# Altium schematic sheet MCU.SchDoc
size A4
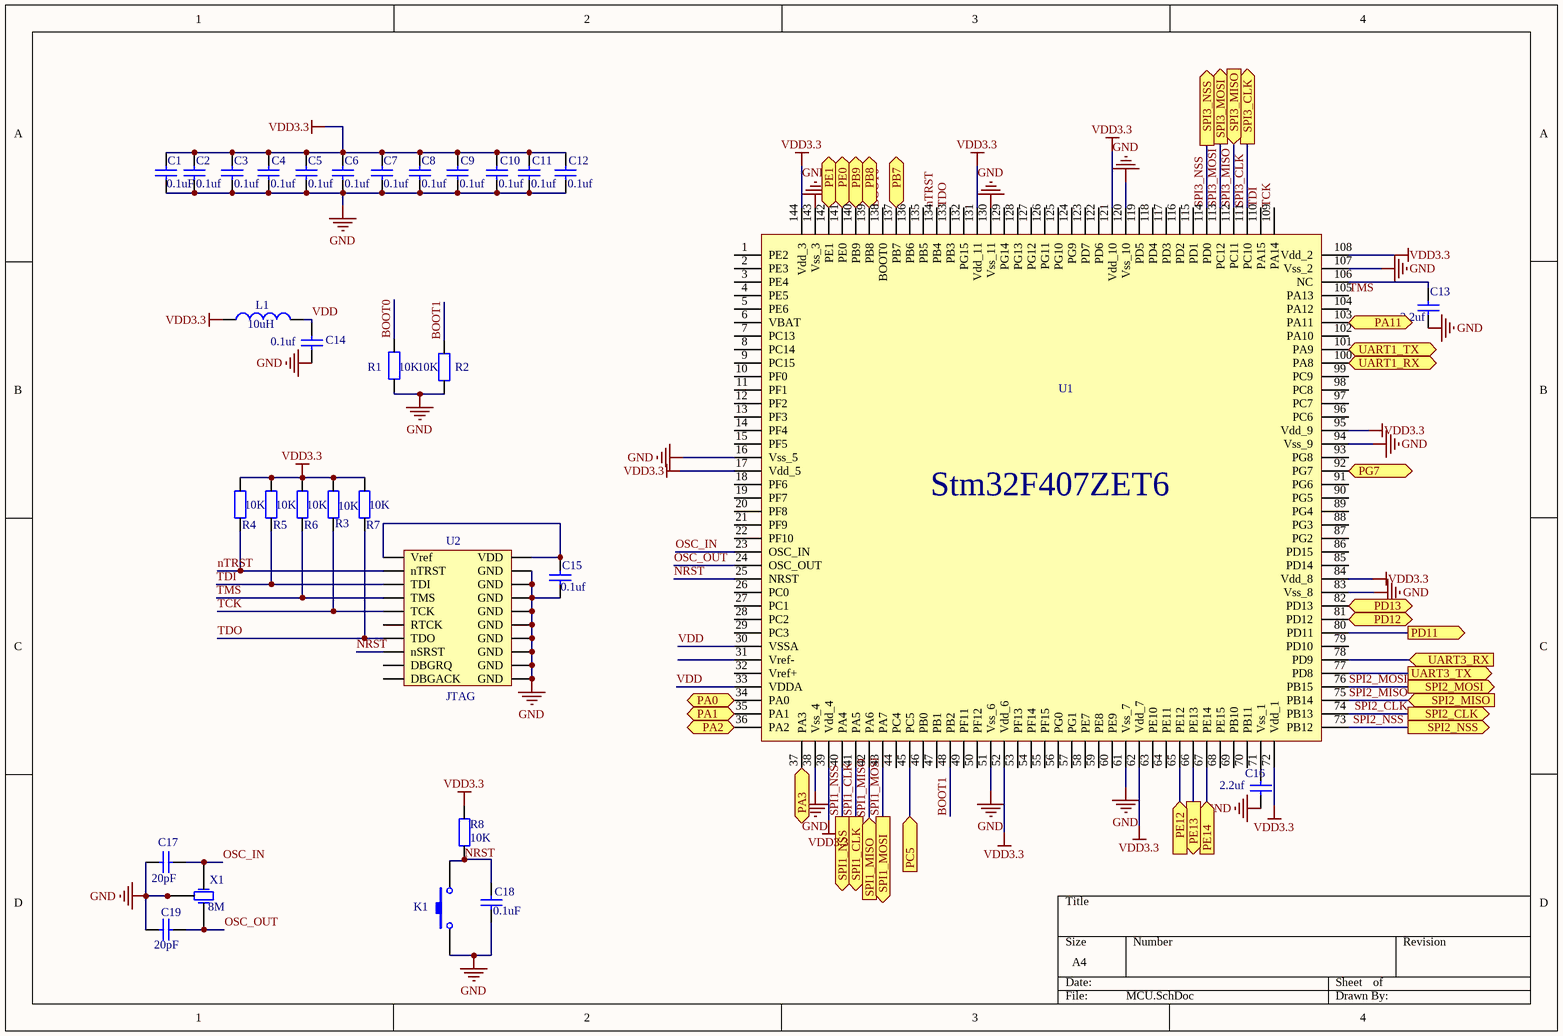
[diagram p0: MCU.SchDoc]

## Parts
C1  value 0.1uF  [0603]  (hidden comment: Capacitor-0805)
C2  value 0.1uf  [0603]  (hidden comment: Capacitor-0805)
C3  value 0.1uf  [0603]  (hidden comment: Capacitor-0805)
C4  value 0.1uf  [0603]  (hidden comment: Capacitor-0805)
C5  value 0.1uf  [0603]  (hidden comment: Capacitor-0805)
C6  value 0.1uf  [0603]  (hidden comment: Capacitor-0805)
C7  value 0.1uf  [0603]  (hidden comment: Capacitor-0805)
C8  value 0.1uf  [0603]  (hidden comment: Capacitor-0805)
C9  value 0.1uf  [0603]  (hidden comment: Capacitor-0805)
C10  value 0.1uf  [0603]  (hidden comment: Capacitor-0805)
C11  value 0.1uf  [0603]  (hidden comment: Capacitor-0805)
C12  value 0.1uf  [0603]  (hidden comment: Capacitor-0805)
C13  value 2.2uf  [0603]  (hidden comment: Capacitor-0603)
C14  value 0.1uf  [0603]  (hidden comment: Capacitor-0805)
C15  value 0.1uf  [0603]  (hidden comment: Capacitor-0805)
C16  value 2.2uf  [0603]  (hidden comment: Capacitor-0603)
C17  value 20pF  [0603]  (hidden comment: Capacitor-0805)
C18  value 0.1uF  [0603]  (hidden comment: Capacitor-0805)
C19  value 20pF  [0603]  (hidden comment: Capacitor-0805)
K1  按键  [贴片按键]  (value not drawn)
L1  value 10uH  [0805]  (hidden comment: Inductor)
R1  value 10K  [0603]  (hidden comment: Resistor-0805)
R2  value 10K  [0603]  (hidden comment: Resistor-0805)
R3  value 10K  [0603]  (hidden comment: Resistor-0805)
R4  value 10K  [0603]  (hidden comment: Resistor-0805)
R5  value 10K  [0603]  (hidden comment: Resistor-0805)
R6  value 10K  [0603]  (hidden comment: Resistor-0805)
R7  value 10K  [0603]  (hidden comment: Resistor-0805)
R8  value 10K  [0603]  (hidden comment: Resistor-0805)
U1  STM32F407ZET6  [Stm32f407ZET6 - duplicate]  (value not drawn)
U2  JTAG  [JTAG-20]
X1  value 8M  [3225无源晶振]  (hidden comment: 3225无源晶振)

## Ports
PA0 (in), PA1 (out), PA2 (out), PA3 (out), PA11 (out), PB7 (out), PB8 (out), PB9 (out), PC5 (in), PD11 (out), PD12, PD13, PE0 (out), PE1 (out), PE12 (in), PE13 (out), PE14 (in), PG7 (out), SPI1_CLK (out), SPI1_MISO (in), SPI1_MOSI (out), SPI1_NSS (out), SPI2_CLK (out), SPI2_MISO (in), SPI2_MOSI (out), SPI2_NSS (out), SPI3_CLK (out), SPI3_MISO (in), SPI3_MOSI (out), SPI3_NSS (out), UART1_RX (in), UART1_TX (out), UART3_RX (in), UART3_TX (out)

## Nets
GND: C1.1 C2.1 C3.1 C4.1 C5.1 C6.1 C7.1 C8.1 C9.1 C10.1 C11.1 C12.1 C13.1 C14.1 C15.1 C16.1 C17.1 C18.1 C19.1 K1.1 R1.1 R2.1 U1.16(Vss_5) U1.38(Vss_4) U1.51(Vss_6) U1.61(Vss_7) U1.83(Vss_8) U1.94(Vss_9) U1.107(Vss_2) U1.120(Vss_10) U1.130(Vss_11) U1.143(Vss_3) U2.4(GND) U2.6(GND) U2.8(GND) U2.10(GND) U2.12(GND) U2.14(GND) U2.16(GND) U2.18(GND) U2.20(GND) X1.2(GND) X1.4(GND)
VDD3.3: C1.2 C2.2 C3.2 C4.2 C5.2 C6.2 C7.2 C8.2 C9.2 C10.2 C11.2 C12.2 L1.1 R3.2 R4.2 R5.2 R6.2 R7.2 R8.2 U1.17(Vdd_5) U1.39(Vdd_4) U1.52(Vdd_6) U1.62(Vdd_7) U1.72(Vdd_1) U1.84(Vdd_8) U1.95(Vdd_9) U1.108(Vdd_2) U1.121(Vdd_10) U1.131(Vdd_11) U1.144(Vdd_3)
BOOT0: R1.2 U1.138(BOOT0)
BOOT1: R2.2 U1.48(PB2)
NRST: C18.2 K1.2 R8.1 U1.25(NRST) U2.15(nSRST)
nTRST: R4.1 U1.134(PB4) U2.3(nTRST)
OSC_IN: C17.2 U1.23(OSC_IN) X1.1(OSC1)
OSC_OUT: C19.2 U1.24(OSC_OUT) X1.3(OSC2)
PA0: U1.34(PA0) ; port PA0
PA1: U1.35(PA1) ; port PA1
PA2: U1.36(PA2) ; port PA2
PA3: U1.37(PA3) ; port PA3
PA11: U1.103(PA11) ; port PA11
PB7: U1.137(PB7) ; port PB7
PB8: U1.139(PB8) ; port PB8
PB9: U1.140(PB9) ; port PB9
PC5: U1.45(PC5) ; port PC5
PD11: U1.80(PD11) ; port PD11
PD12: U1.81(PD12) ; port PD12
PD13: U1.82(PD13) ; port PD13
PE0: U1.141(PE0) ; port PE0
PE1: U1.142(PE1) ; port PE1
PE12: U1.65(PE12) ; port PE12
PE13: U1.66(PE13) ; port PE13
PE14: U1.67(PE14) ; port PE14
PG7: U1.92(PG7) ; port PG7
SPI1_CLK: U1.41(PA5) ; port SPI1_CLK
SPI1_MISO: U1.42(PA6) ; port SPI1_MISO
SPI1_MOSI: U1.43(PA7) ; port SPI1_MOSI
SPI1_NSS: U1.40(PA4) ; port SPI1_NSS
SPI2_CLK: U1.74(PB13) ; port SPI2_CLK
SPI2_MISO: U1.75(PB14) ; port SPI2_MISO
SPI2_MOSI: U1.76(PB15) ; port SPI2_MOSI
SPI2_NSS: U1.73(PB12) ; port SPI2_NSS
SPI3_CLK: U1.111(PC10) ; port SPI3_CLK
SPI3_MISO: U1.112(PC11) ; port SPI3_MISO
SPI3_MOSI: U1.113(PC12) ; port SPI3_MOSI
SPI3_NSS: U1.114(PD0) ; port SPI3_NSS
TCK: R3.1 U1.109(PA14) U2.9(TCK)
TDI: R5.1 U1.110(PA15) U2.5(TDI)
TDO: R7.1 U1.133(PB3) U2.13(TDO)
TMS: R6.1 U1.105(PA13) U2.7(TMS)
UART1_RX: U1.100(PA8) ; port UART1_RX
UART1_TX: U1.101(PA9) ; port UART1_TX
UART3_RX: U1.78(PD9) ; port UART3_RX
UART3_TX: U1.77(PD8) ; port UART3_TX
VDD: C14.2 L1.2 U1.30(VSSA) U1.33(VDDA)
NetC13_2: C13.2 U1.106(NC)
NetC15_2: C15.2 U2.1(Vref) U2.2(VDD)
NetC16_2: C16.2 U1.71(Vss_1)

Not connected (* = marked no-connect by the designer): U1 1(PE2) 2(PE3) 3(PE4) 4(PE5) 5(PE6) 6(VBAT) 7(PC13) 8(PC14) 9(PC15) 10(PF0) 11(PF1) 12(PF2) 13(PF3) 14(PF4) 15(PF5) 18(PF6) 19(PF7) 20(PF8) 21(PF9) 22(PF10) 26(PC0) 27(PC1) 28(PC2) 29(PC3) 31(Vref-) 32(Vref+) 44(PC4) 46(PB0) 47(PB1) 49(PF11) 50(PF12) 53(PF13) 54(PF14) 55(PF15) 56(PG0) 57(PG1) 58(PE7) 59(PE8) 60(PE9) 63(PE10) 64(PE11) 68(PE15) 69(PB10) 70(PB11) 79(PD10) 85(PD14) 86(PD15) 87(PG2) 88(PG3) 89(PG4) 90(PG5) 91(PG6) 93(PG8) 96(PC6) 97(PC7) 98(PC8) 99(PC9) 102(PA10) 104(PA12) 115(PD1) 116(PD2) 117(PD3) 118(PD4) 119(PD5) 122(PD6) 123(PD7) 124(PG9) 125(PG10) 126(PG11) 127(PG12) 128(PG13) 129(PG14) 132(PG15) 135(PB5) 136(PB6); U2 11(RTCK) 17(DBGRQ) 19(DBGACK)

## Notes on the sheet
- (in symbol STM32F407Z) Stm32F407ZET6

## Library data of the parts
C1-C12 C14 C15 = Capacitor
C17-C19 = Capacitor-0
L1 = Ind
R1 R2 = Resistor
R3-R8 = Resistor-0
U1 = STM32F407Z: Value: STM32F407ZGT6
U2 = J: Value: JTAG